# Altium schematic sheet Accelerometer.SchDoc
size 420 x 297 mm; SheetNumber: 2; SheetTotal: 10; PageSetup: Record=PageOptions|CenterHorizontal=True|CenterVertical=True|PrintScale=0.96|XCorrection=1.00|YCorrection=1.00|PrintKind=1|BorderSize=5000000|LeftOffset=0|BottomOffset=0|Orientation=2|PaperLength=4318|PaperWidth=2794|Scale=100|PaperSource=7|PrintQuality=600|MediaType=1|DitherType=10|PaperKind=11" x 17"|PrintScaleMode=1
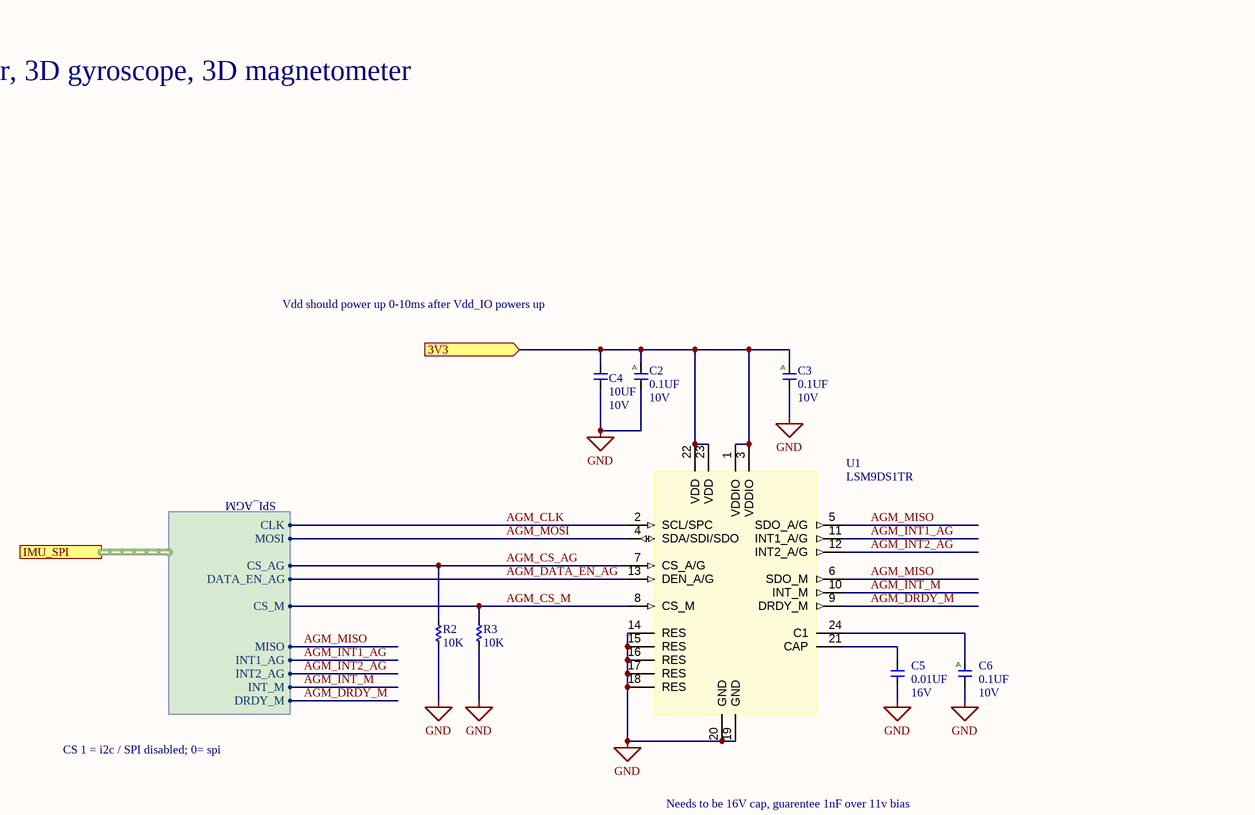
[diagram p0: Accelerometer.SchDoc]

## Parts
C2  value 0.1UF  Voltage: 10V  [C0201Y]  (hidden comment: __Template_Cap_Auto)
C3  value 0.1UF  Voltage: 10V  [C0201Y]  (hidden comment: __Template_Cap_Auto)
C4  value 10UF  Voltage: 10V  [C0402]  (hidden comment: __Template_Cap)
C5  value 0.01UF  Voltage: 16V  [C0201Y]  (hidden comment: __Template_Cap)
C6  value 0.1UF  Voltage: 10V  [C0201Y]  (hidden comment: __Template_Cap_Auto)
R2  value 10K  [R0201_H0.26MM]  (hidden comment: __Template_Resistor)
R3  value 10K  [R0201_H0.26MM]  (hidden comment: __Template_Resistor)
U1  Mfg P/N: LSM9DS1TR  [LGA24RX8X4_350X100X102]  (hidden comment: SENSOR_ST_LSM9DS1TR)

## Ports
3V3 (in), IMU_SPI (harness SPI_AGM)

## Harnesses
SPI_AGM: CLK, CS_AG, MOSI, MISO, CS_M, DATA_EN_AG, INT1_AG, INT2_AG, INT_M, DRDY_M

## Nets
GND: C2.2 C3.2 C4.2 C5.2 C6.2 R2.1 R3.1 U1.14(RES) U1.15(RES) U1.16(RES) U1.17(RES) U1.18(RES) U1.19(GND) U1.20(GND)
3V3: C2.1 C3.1 C4.1 U1.1(VDDIO) U1.3(VDDIO) U1.22(VDD) U1.23(VDD) ; port 3V3
AGM_CLK: U1.2(SCL/SPC) ; port IMU_SPI.CLK
AGM_CS_AG: R2.2 U1.7(CS_A/G) ; port IMU_SPI.CS_AG
AGM_CS_M: R3.2 U1.8(CS_M) ; port IMU_SPI.CS_M
AGM_DATA_EN_AG: U1.13(DEN_A/G) ; port IMU_SPI.DATA_EN_AG
AGM_DRDY_M: U1.9(DRDY_M) ; port IMU_SPI.DRDY_M
AGM_INT1_AG: U1.11(INT1_A/G) ; port IMU_SPI.INT1_AG
AGM_INT2_AG: U1.12(INT2_A/G) ; port IMU_SPI.INT2_AG
AGM_INT_M: U1.10(INT_M) ; port IMU_SPI.INT_M
AGM_MISO: U1.5(SDO_A/G) U1.6(SDO_M) ; port IMU_SPI.MISO
AGM_MOSI: U1.4(SDA/SDI/SDO) ; port IMU_SPI.MOSI
NetC5_1: C5.1 U1.21(CAP)
NetC6_1: C6.1 U1.24(C1)

## Notes on the sheet
- 3D accelerometer, 3D gyroscope, 3D magnetometer
- Vdd should power up 0-10ms after Vdd_IO powers up
- CS 1 = i2c / SPI disabled; 0= spi
- Needs to be 16V cap, guarentee 1nF over 11v bias
- CREATIVE COMMONS
- PUBLIC LICENSE:
- BARKOUR ROBOT
- CC BY-NC 4.0
- APPROVED
- DWG NO
- GOOGLE LLC
- FILE
- RELEASED
- 2024/05/09
- SIZE
- 1600 AMPHITHEATRE PARKWAY
- MOUNTAIN VIEW CA 94043
- A3
- SHEET
- OF
- THIS DESIGN IS BEING PROVIDED  FOR NON-COMMERCIAL USE ONLY. THE USE OF =SCIENTIST_NAME_POSSESSIVE NAME IN CONNECTION WITH THE DESIGN IS NOT INTENDED TO IMPLY THAT =SCIENTIST_NAME SPONSORS OR ENDORSES THE DESIGN, GOOGLE LLC, OR ANY OF GOOGLE LLC'S PRODUCTS OR SERVICES.
- (in symbol 934) A

## Library data of the parts
C2 C3 C6 = 934: CAP, CER, X6S, 0.1uF, 10V, 10%, 0201, AUTOGRADE; ID: 934; MFG: MURATA; MFG P/N: GRT033C81A104KE01D; XPN: 150-01178-00; Gecko: 150-04546-00; EES: 150-04563-00; Status: Released; Package: 0201; Dielectric: X6S; Tolerance: 10%; Height: 0.33mm T; Supplier 1: Digi-key; HelpURL: https://www.digikey.com/product-detail/en/murata-electronics/GRT033C81A104KE01D/490-12232-1-ND/5416933; ComponentLink1Description: Datasheet; ComponentLink1URL: https://search.murata.co.jp/Ceramy/image/img/A01X/G101/ENG/GRT033C81A104KE01-01.pdf; COMMON: 150-01178-00; LOON: 150-01178-00; Supplier Part Number 1: 490-12232-1-ND
C4 = 215: CAP, CER, X5R, 10uF, 10V, 20%, 0402, 0.7mm T; ID: 215; MFG: SAMSUNG; MFG P/N: CL05A106MP5NUNC; XPN: 150-00376-00; PROXY: Use ID #1342; EES: 150-04565-00; Status: Released; Package: 0402; Dielectric: X5R; Tolerance: 20%; Height: 0.7mm T; ComponentLink1Description: Datasheet; COMMON: 150-00376-00; LOON: 150-00376-00; Gecko: 150-00376-00
C5 = 1238: CAP, CER, X5R, 0.01uF, 16V, 10%, 0201, 0.33mm T; ID: 1238; MFG: MURATA; MFG P/N: GRM033R61C103KA12D; XPN: 150-00126-00; EES: 150-04566-00; Status: Released; Package: 0201; Dielectric: X5R; Tolerance: 10%; Height: 0.33mm T; ComponentLink1Description: Datasheet; COMMON: 150-00126-00; LOON: 150-00126-00; Gecko: 150-00126-00
R2 R3 = 6783: RES, 10K, 1%, 1/20W, 0201, AUTOGRADE; ID: 6783; MFG: PANASONIC; MFG P/N: ERJ1GNF1002C; COMMON: 470-00033-00; PROXY: Use ID #4151; EES: 470-18014-00; Status: Released; Package: 0201; Power: 1/20W; Tolerance: 1%; Height: 0.26mm; Supplier 1: Digi-Key; HelpURL: https://www.digikey.in/product-detail/en/panasonic-electronic-components/ERJ-1GNF1002C/P122414CT-ND/7389440; ComponentLink1Description: Datasheet; ComponentLink1URL: https://industrial.panasonic.com/cdbs/www-data/pdf/RDA0000/AOA0000C304.pdf; LOON: 470-00033-00; Gecko: 470-00033-00; XPN: 470-00033-00; Supplier Part Number 1: P122414CT-ND
U1 = 172: SENSOR, MOTION, IMU, ACCELEROMETER/GYROSCOPE/MAGNETOMETER, I2C, SPI, LGA-24; ID: 172; Mfg: STMicroelectronics; OUTPUT TYPE: I²C, SPI; SENSOR TYPE: Accelerometer, Gyroscope, Magnetometer, Temperature, 9 Axis; EES: 550-00589-00; Status: Released; Package: 24-LGA; Category: Sensors; RoHS Compliant: Yes; Mounting Type: Surface Mount; Supplier 1: Digi-Key; HEIGHT (MAX): 1.027mm; OPERATING TEMPERATURE: -40°C ~ 85°C (TA); HelpURL: https://www.digikey.com/product-detail/en/stmicroelectronics/LSM9DS1TR/497-14946-1-ND/4988079; ComponentLink1Description: Datasheet; ComponentLink1URL: https://www.st.com/content/ccc/resource/technical/document/datasheet/1e/3f/2a/d6/25/eb/48/46/DM00103319.pdf/files/DM00103319.pdf/jcr:content/translations/en.DM00103319.pdf; Height: 1.027mm; Supplier Part Number 1: 497-14946-1-ND